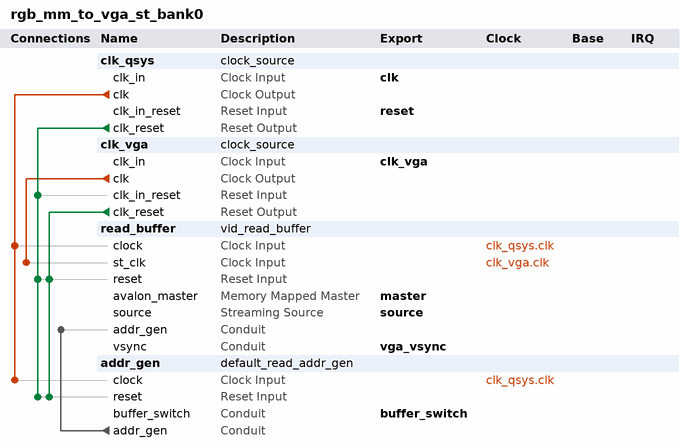
[diagram p0: system contents]
# Platform Designer (Qsys) system rgb_mm_to_vga_st_bank0, Cyclone IV GX EP4CGX150DF31C7
# Parameters at their usual value, and those the tool derives, are not listed.
package require -exact qsys 15.0
create_system rgb_mm_to_vga_st_bank0
set_project_property DEVICE_FAMILY {Cyclone IV GX}
set_project_property DEVICE EP4CGX150DF31C7

add_instance clk_qsys clock_source 15.0
set_instance_parameter_value clk_qsys clockFrequency 1000000000
set_instance_parameter_value clk_qsys clockFrequencyKnown false

add_instance clk_vga clock_source 15.0
set_instance_parameter_value clk_vga clockFrequency 25000000
set_instance_parameter_value clk_vga clockFrequencyKnown false

add_instance read_buffer vid_read_buffer 1.0
set_instance_parameter_value read_buffer ADDR_WIDTH 27
set_instance_parameter_value read_buffer DATA_WIDTH 32
set_instance_parameter_value read_buffer FIFO_LENGTH_LOG_2 6

add_instance addr_gen default_read_addr_gen 1.0
set_instance_parameter_value addr_gen ADDR_WIDTH 27
set_instance_parameter_value addr_gen BANK 0
set_instance_parameter_value addr_gen HEIGHT 480
set_instance_parameter_value addr_gen WIDTH 640

# connections
add_connection clk_qsys.clk addr_gen.clock clock
add_connection clk_qsys.clk read_buffer.clock clock
add_connection clk_vga.clk read_buffer.st_clk clock
add_connection clk_qsys.clk_reset addr_gen.reset reset
add_connection clk_qsys.clk_reset clk_vga.clk_in_reset reset
add_connection clk_qsys.clk_reset read_buffer.reset reset
add_connection clk_vga.clk_reset addr_gen.reset reset
add_connection clk_vga.clk_reset read_buffer.reset reset
add_connection addr_gen.addr_gen read_buffer.addr_gen conduit

# exported interfaces
add_interface buffer_switch conduit end
set_interface_property buffer_switch EXPORT_OF addr_gen.buffer_switch
add_interface clk clock sink
set_interface_property clk EXPORT_OF clk_qsys.clk_in
add_interface clk_vga clock sink
set_interface_property clk_vga EXPORT_OF clk_vga.clk_in
add_interface master avalon master
set_interface_property master EXPORT_OF read_buffer.avalon_master
add_interface reset reset sink
set_interface_property reset EXPORT_OF clk_qsys.clk_in_reset
add_interface source avalon_streaming source
set_interface_property source EXPORT_OF read_buffer.source
add_interface vga_vsync conduit end
set_interface_property vga_vsync EXPORT_OF read_buffer.vsync

set_interconnect_requirement {$system} qsys_mm.clockCrossingAdapter HANDSHAKE
set_interconnect_requirement {$system} qsys_mm.enableEccProtection FALSE
set_interconnect_requirement {$system} qsys_mm.insertDefaultSlave FALSE
set_interconnect_requirement {$system} qsys_mm.maxAdditionalLatency 1

save_system rgb_mm_to_vga_st_bank0.qsys
